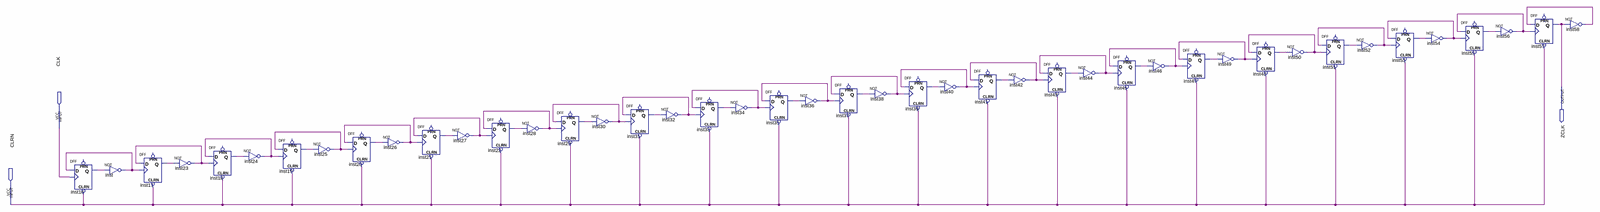
[diagram p0: schematic sheet, whole]
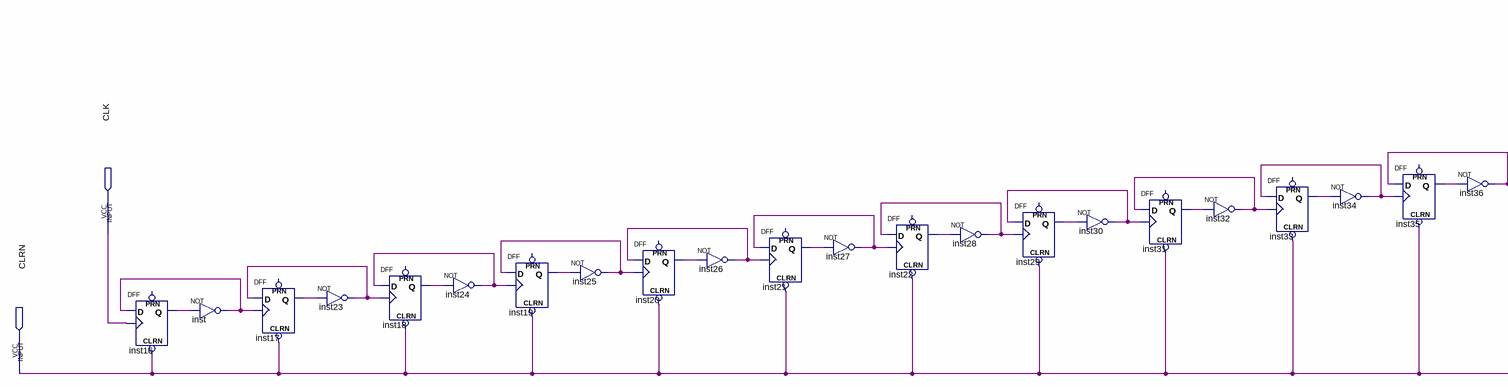
[diagram p1: schematic sheet, left part]
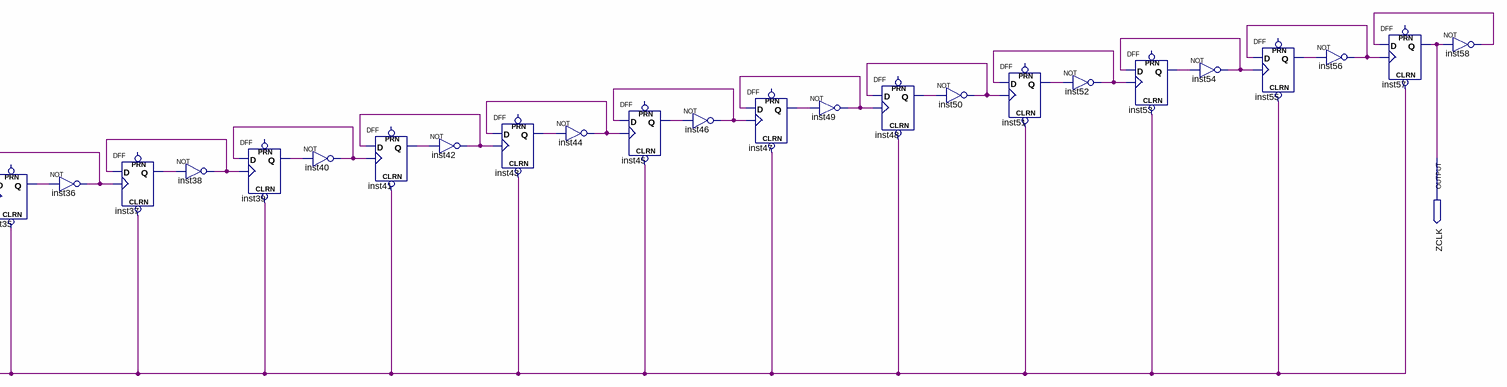
[diagram p2: schematic sheet, right part]
// Quartus schematic Frequency_Divider.bdf as structural Verilog: 44 symbols, 3 pins
module Frequency_Divider (
  input  CLK,
  input  CLRN,
  output ZCLK
);

  wire inst16_q, inst17_q, inst18_q, inst19_q, inst20_q, inst21_q, inst22_q, inst23_out, inst24_out,
       inst25_out, inst26_out, inst27_out, inst28_out, inst29_q, inst30_out, inst31_q, inst32_out, inst33_q,
       inst34_out, inst35_q, inst36_out, inst37_q, inst38_out, inst39_q, inst40_out, inst41_q, inst42_out,
       inst43_q, inst44_out, inst45_q, inst46_out, inst47_q, inst48_q, inst49_out, inst50_out, inst51_q,
       inst52_out, inst53_q, inst54_out, inst55_q, inst56_out, inst58_out, inst_out;

  DFF inst16 (.CLRN(CLRN), .CLK(CLK), .D(inst_out), .Q(inst16_q));  // open: PRN
  not inst (inst_out, inst16_q);
  DFF inst17 (.CLRN(CLRN), .CLK(inst_out), .D(inst23_out), .Q(inst17_q));  // open: PRN
  not inst23 (inst23_out, inst17_q);
  DFF inst18 (.CLRN(CLRN), .CLK(inst23_out), .D(inst24_out), .Q(inst18_q));  // open: PRN
  not inst24 (inst24_out, inst18_q);
  DFF inst19 (.CLRN(CLRN), .CLK(inst24_out), .D(inst25_out), .Q(inst19_q));  // open: PRN
  not inst25 (inst25_out, inst19_q);
  DFF inst20 (.CLRN(CLRN), .CLK(inst25_out), .D(inst26_out), .Q(inst20_q));  // open: PRN
  not inst26 (inst26_out, inst20_q);
  DFF inst21 (.CLRN(CLRN), .CLK(inst26_out), .D(inst27_out), .Q(inst21_q));  // open: PRN
  not inst27 (inst27_out, inst21_q);
  DFF inst22 (.CLRN(CLRN), .CLK(inst27_out), .D(inst28_out), .Q(inst22_q));  // open: PRN
  not inst28 (inst28_out, inst22_q);
  DFF inst29 (.CLRN(CLRN), .CLK(inst28_out), .D(inst30_out), .Q(inst29_q));  // open: PRN
  not inst30 (inst30_out, inst29_q);
  DFF inst31 (.CLRN(CLRN), .CLK(inst30_out), .D(inst32_out), .Q(inst31_q));  // open: PRN
  not inst32 (inst32_out, inst31_q);
  DFF inst33 (.CLRN(CLRN), .CLK(inst32_out), .D(inst34_out), .Q(inst33_q));  // open: PRN
  not inst34 (inst34_out, inst33_q);
  DFF inst35 (.CLRN(CLRN), .CLK(inst34_out), .D(inst36_out), .Q(inst35_q));  // open: PRN
  not inst36 (inst36_out, inst35_q);
  DFF inst37 (.CLRN(CLRN), .CLK(inst36_out), .D(inst38_out), .Q(inst37_q));  // open: PRN
  not inst38 (inst38_out, inst37_q);
  DFF inst39 (.CLRN(CLRN), .CLK(inst38_out), .D(inst40_out), .Q(inst39_q));  // open: PRN
  not inst40 (inst40_out, inst39_q);
  DFF inst41 (.CLRN(CLRN), .CLK(inst40_out), .D(inst42_out), .Q(inst41_q));  // open: PRN
  not inst42 (inst42_out, inst41_q);
  DFF inst43 (.CLRN(CLRN), .CLK(inst42_out), .D(inst44_out), .Q(inst43_q));  // open: PRN
  not inst44 (inst44_out, inst43_q);
  DFF inst45 (.CLRN(CLRN), .CLK(inst44_out), .D(inst46_out), .Q(inst45_q));  // open: PRN
  not inst46 (inst46_out, inst45_q);
  DFF inst47 (.CLRN(CLRN), .CLK(inst46_out), .D(inst49_out), .Q(inst47_q));  // open: PRN
  not inst49 (inst49_out, inst47_q);
  DFF inst48 (.CLRN(CLRN), .CLK(inst49_out), .D(inst50_out), .Q(inst48_q));  // open: PRN
  not inst50 (inst50_out, inst48_q);
  DFF inst51 (.CLRN(CLRN), .CLK(inst50_out), .D(inst52_out), .Q(inst51_q));  // open: PRN
  not inst52 (inst52_out, inst51_q);
  DFF inst53 (.CLRN(CLRN), .CLK(inst52_out), .D(inst54_out), .Q(inst53_q));  // open: PRN
  not inst54 (inst54_out, inst53_q);
  DFF inst55 (.CLRN(CLRN), .CLK(inst54_out), .D(inst56_out), .Q(inst55_q));  // open: PRN
  not inst56 (inst56_out, inst55_q);
  DFF inst57 (.CLRN(CLRN), .CLK(inst56_out), .D(inst58_out), .Q(ZCLK));  // open: PRN
  not inst58 (inst58_out, ZCLK);
endmodule
